# Altium schematic sheet conn.SchDoc
size A4; DocumentNumber: 11; SheetNumber: 11; SheetTotal: 11
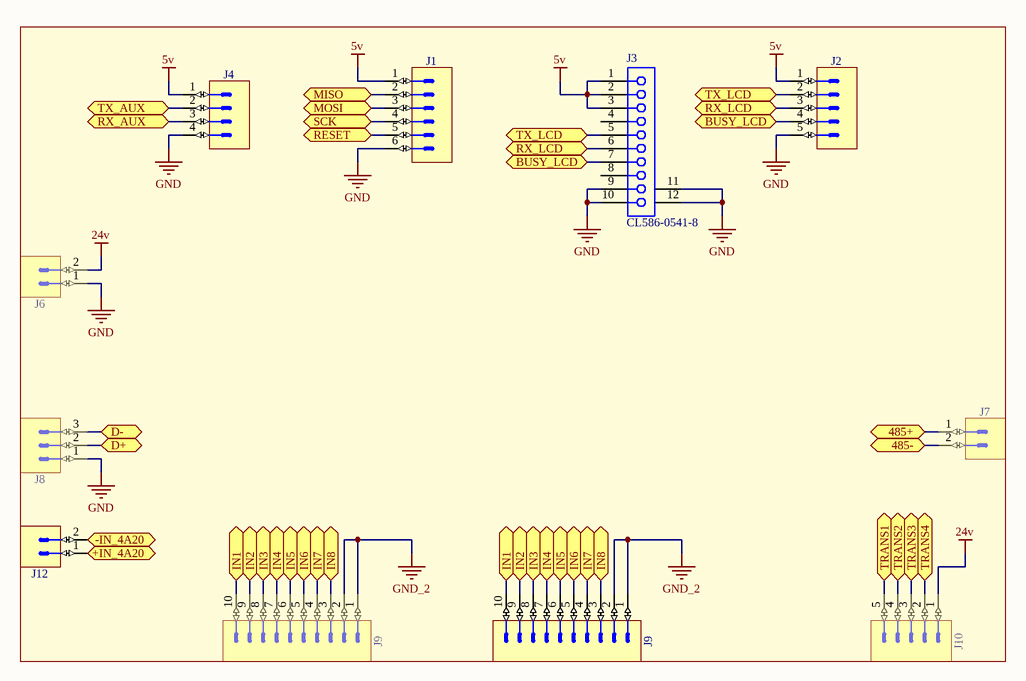
[diagram p0: conn.SchDoc]

## Parts
(Parts that share a designator on the sheet are numbered #1, #2 ... from top to bottom, then left to right.)
J1  KK®  [MOLEX_22-27-2061]  (value not drawn)
J2  KK®  [MOLEX_22-27-2051]  (value not drawn)
J3  CL586-0541-8  [FH12-22(10)SA-1SH]
J4  KK®  [MOLEX_22-27-2041]  (value not drawn)
J6  (no value)  [PHOENIX_1757242]
J7  (no value)  [PHOENIX_1757242]
J8  (no value)  [PHOENIX_1757255]
J9#1  (no value)  [PHOENIX_1757323]
J9#2  (no value)  [PHOENIX_1757323]
J10  (no value)  [PHOENIX_1757271]
J12  (no value)  [PHOENIX_1757242]

## Ports
485+, 485-, +IN_4A20, -IN_4A20, BUSY_LCD, D+, D-, IN1, IN2, IN3, IN4, IN5, IN6, IN7, IN8, MISO, MOSI, RESET, RX_AUX, RX_LCD, SCK, TRANS1, TRANS2, TRANS3, TRANS4, TX_AUX, TX_LCD

## Nets
5v: J1.1 J2.1 J3.1 J3.2 J3.3 J4.1
24v: J6.2 J10.1
GND: J1.6 J2.5 J3.9 J3.10 J3.11(MH1) J3.12(MH2) J4.4 J6.1 J8.1
GND_2: J9#1.1 J9#1.2 J9#2.1 J9#2.2
485+: J7.1 ; port 485+
485-: J7.2 ; port 485-
+IN_4A20: J12.1 ; port +IN_4A20
-IN_4A20: J12.2 ; port -IN_4A20
BUSY_LCD: J2.4 J3.7 ; port BUSY_LCD
D+: J8.2 ; port D+
D-: J8.3 ; port D-
IN1: J9#1.10 J9#2.10 ; port IN1
IN2: J9#1.9 J9#2.9 ; port IN2
IN3: J9#1.8 J9#2.8 ; port IN3
IN4: J9#1.7 J9#2.7 ; port IN4
IN5: J9#1.6 J9#2.6 ; port IN5
IN6: J9#1.5 J9#2.5 ; port IN6
IN7: J9#1.4 J9#2.4 ; port IN7
IN8: J9#1.3 J9#2.3 ; port IN8
MISO: J1.2 ; port MISO
MOSI: J1.3 ; port MOSI
RESET: J1.5 ; port RESET
RX_AUX: J4.3 ; port RX_AUX
RX_LCD: J2.3 J3.6 ; port RX_LCD
SCK: J1.4 ; port SCK
TRANS1: J10.5 ; port TRANS1
TRANS2: J10.4 ; port TRANS2
TRANS3: J10.3 ; port TRANS3
TRANS4: J10.2 ; port TRANS4
TX_AUX: J4.2 ; port TX_AUX
TX_LCD: J2.2 J3.5 ; port TX_LCD

Not connected (* = marked no-connect by the designer): J3 4 8

## Library data of the parts
J1 = MOLEX_22-27-2061: Connector 6 Male; Part Description: 2.54mm (.100") Pitch KK® Wire-to-Board Header, Vertical, with Friction Lock, 6 Circuits, Tin (Sn) Plating; Manufacturer: MOLEX; Part Number: MOLEX_22-27-2061; Component Kind: Standard; Component Type: Standard; Pin Count: 6; Family: KK®; Mounted: Yes; Socket: No; SMD: No; Status: None; Manufacturer Part Number: 22-27-2061; ComponentHeight: 11.7mm; HelpURL: \\cern.ch\dfs\Applications\Altium\Datasheets\MOLEX_22-27-2061.pdf; Author: CERN DEM JMW; CreateDate: 30/11/2011; LatestRevisionDate: 30/11/2011; Table: MOLEX
J2 = MOLEX_22-27-2051: Connector 5 Male; Part Description: 2.54mm (.100") Pitch KK® Wire-to-Board Header, Vertical, with Friction Lock, 5 Circuits, Tin (Sn) Plating; Manufacturer: MOLEX; Part Number: MOLEX_22-27-2051; Component Kind: Standard; Component Type: Standard; Pin Count: 5; Family: KK®; Mounted: Yes; Socket: No; SMD: No; Status: None; Manufacturer Part Number: 22-27-2051; ComponentHeight: 11.7mm; HelpURL: \\cern.ch\dfs\Applications\Altium\Datasheets\MOLEX_22-27-2051.pdf; Author: CERN DEM JLC; CreateDate: 04/12/2008; LatestRevisionDate: 04/12/2008; Table: MOLEX
J3 = CL586-0541-8: FH12 Series, "Flip-Lock" SMT/ZIF FFC/FPC Connector - 1.0mm Spaced Bottom Eccentric Contact; Positions: 10; ContactMaterial: Phosphor Bronze; Current: 0.5A; PCB_Layout: Complies with manufacturer's recommendation.; Note: Pad dimensions follow nominal values, Suitable for Wave Soldering, Adjust for Re-flow.; Published: 17-Jul-2002; DatasheetVersion: 13-Nov-2000; PackageVersion: 13-Nov-2000; PackageReference: FH12-22(10)SA-1SH; Publisher: Altium Limited; ComponentLink1Description: Manufacturer Link; ComponentLink1URL: http://www.hiroseusa.com/; ComponentLink2Description: Datasheet; ComponentLink2URL: http://www.hirose.co.jp/cataloge_hp/e58605370.pdf
J4 = MOLEX_22-27-2041: Connector 4 Male; Part Description: 2.54mm (.100") Pitch KK® Wire-to-Board Header, Vertical, with Friction Lock, 4 Circuits, Tin (Sn) Plating; Manufacturer: MOLEX; Part Number: MOLEX_22-27-2041; Component Kind: Standard; Component Type: Standard; Pin Count: 4; Family: KK®; Mounted: Yes; Socket: No; SMD: No; Status: None; Manufacturer Part Number: 22-27-2041; ComponentHeight: 11.7mm; HelpURL: \\cern.ch\dfs\Applications\Altium\Datasheets\MOLEX_22-27-2041.pdf; Author: CERN DEM JLC; CreateDate: 04/12/2008; LatestRevisionDate: 04/12/2008; Table: MOLEX
J6 J7 J12 = PHOENIX_1757242: Connector 2 Male; Part Description: 12A, 250V, Pitch 5.08mm, 2 Positions Header; Manufacturer: PHOENIX CONTACT; Manufacturer Part Number: 1757242 (MSTBA 2,5/ 2-G-5,08); Part Number: PHOENIX_1757242; Component Kind: Standard; Component Type: Standard; Pin Count: 2; Mounted: Yes; Socket: No; SMD: No; Status: None; ComponentHeight: 8.6mm; HelpURL: \\cern.ch\dfs\Applications\Altium\Datasheets\PHOENIX_1757242.pdf; Author: CERN DEM JLC; CreateDate: 10/02/2010; LatestRevisionDate: 26/04/2010; Table: PHOENIX
J8 = PHOENIX_1757255: Connector 3 Male; Part Description: 12A, 250V, Pitch 5.08mm, 3 Positions Header; Manufacturer: PHOENIX CONTACT; Manufacturer Part Number: 1757255 (MSTBA 2,5/ 3-G-5,08); Part Number: PHOENIX_1757255; Component Kind: Standard; Component Type: Standard; Pin Count: 3; Mounted: Yes; Socket: No; SMD: No; Status: None; ComponentHeight: 8.6mm; HelpURL: \\cern.ch\dfs\Applications\Altium\Datasheets\PHOENIX_1757255.pdf; Author: CERN DEM JLC; CreateDate: 10/02/2010; LatestRevisionDate: 26/04/2010; Table: PHOENIX
J9#1 J9#2 = PHOENIX_1757323: Connector 10 Male; Part Description: 12A, 250V, Pitch 5.08mm, 10 Positions Header; Manufacturer: PHOENIX CONTACT; Manufacturer Part Number: 1757323 (MSTBA 2,5/ 10-G-5,08); Part Number: PHOENIX_1757323; Component Kind: Standard; Component Type: Standard; Pin Count: 10; Mounted: Yes; Socket: No; SMD: No; Status: None; ComponentHeight: 8.6mm; HelpURL: \\cern.ch\dfs\Applications\Altium\Datasheets\PHOENIX_1757323.pdf; Author: CERN DEM JLC; CreateDate: 10/02/2010; LatestRevisionDate: 26/04/2010; Table: PHOENIX
J10 = PHOENIX_1757271: Connector 5 Male; Part Description: 12A, 250V, Pitch 5.08mm, 5 Positions Header; Manufacturer: PHOENIX CONTACT; Manufacturer Part Number: 1757271 (MSTBA 2,5/ 5-G-5,08); Part Number: PHOENIX_1757271; Component Kind: Standard; Component Type: Standard; Pin Count: 5; Mounted: Yes; Socket: No; SMD: No; Status: None; ComponentHeight: 8.6mm; HelpURL: \\cern.ch\dfs\Applications\Altium\Datasheets\PHOENIX_1757271.pdf; Author: CERN DEM JLC; CreateDate: 10/02/2010; LatestRevisionDate: 26/04/2010; Table: PHOENIX